# EAGLE design 80W Hi-Fi Power Amplifier (EAGLE 9.4.2)
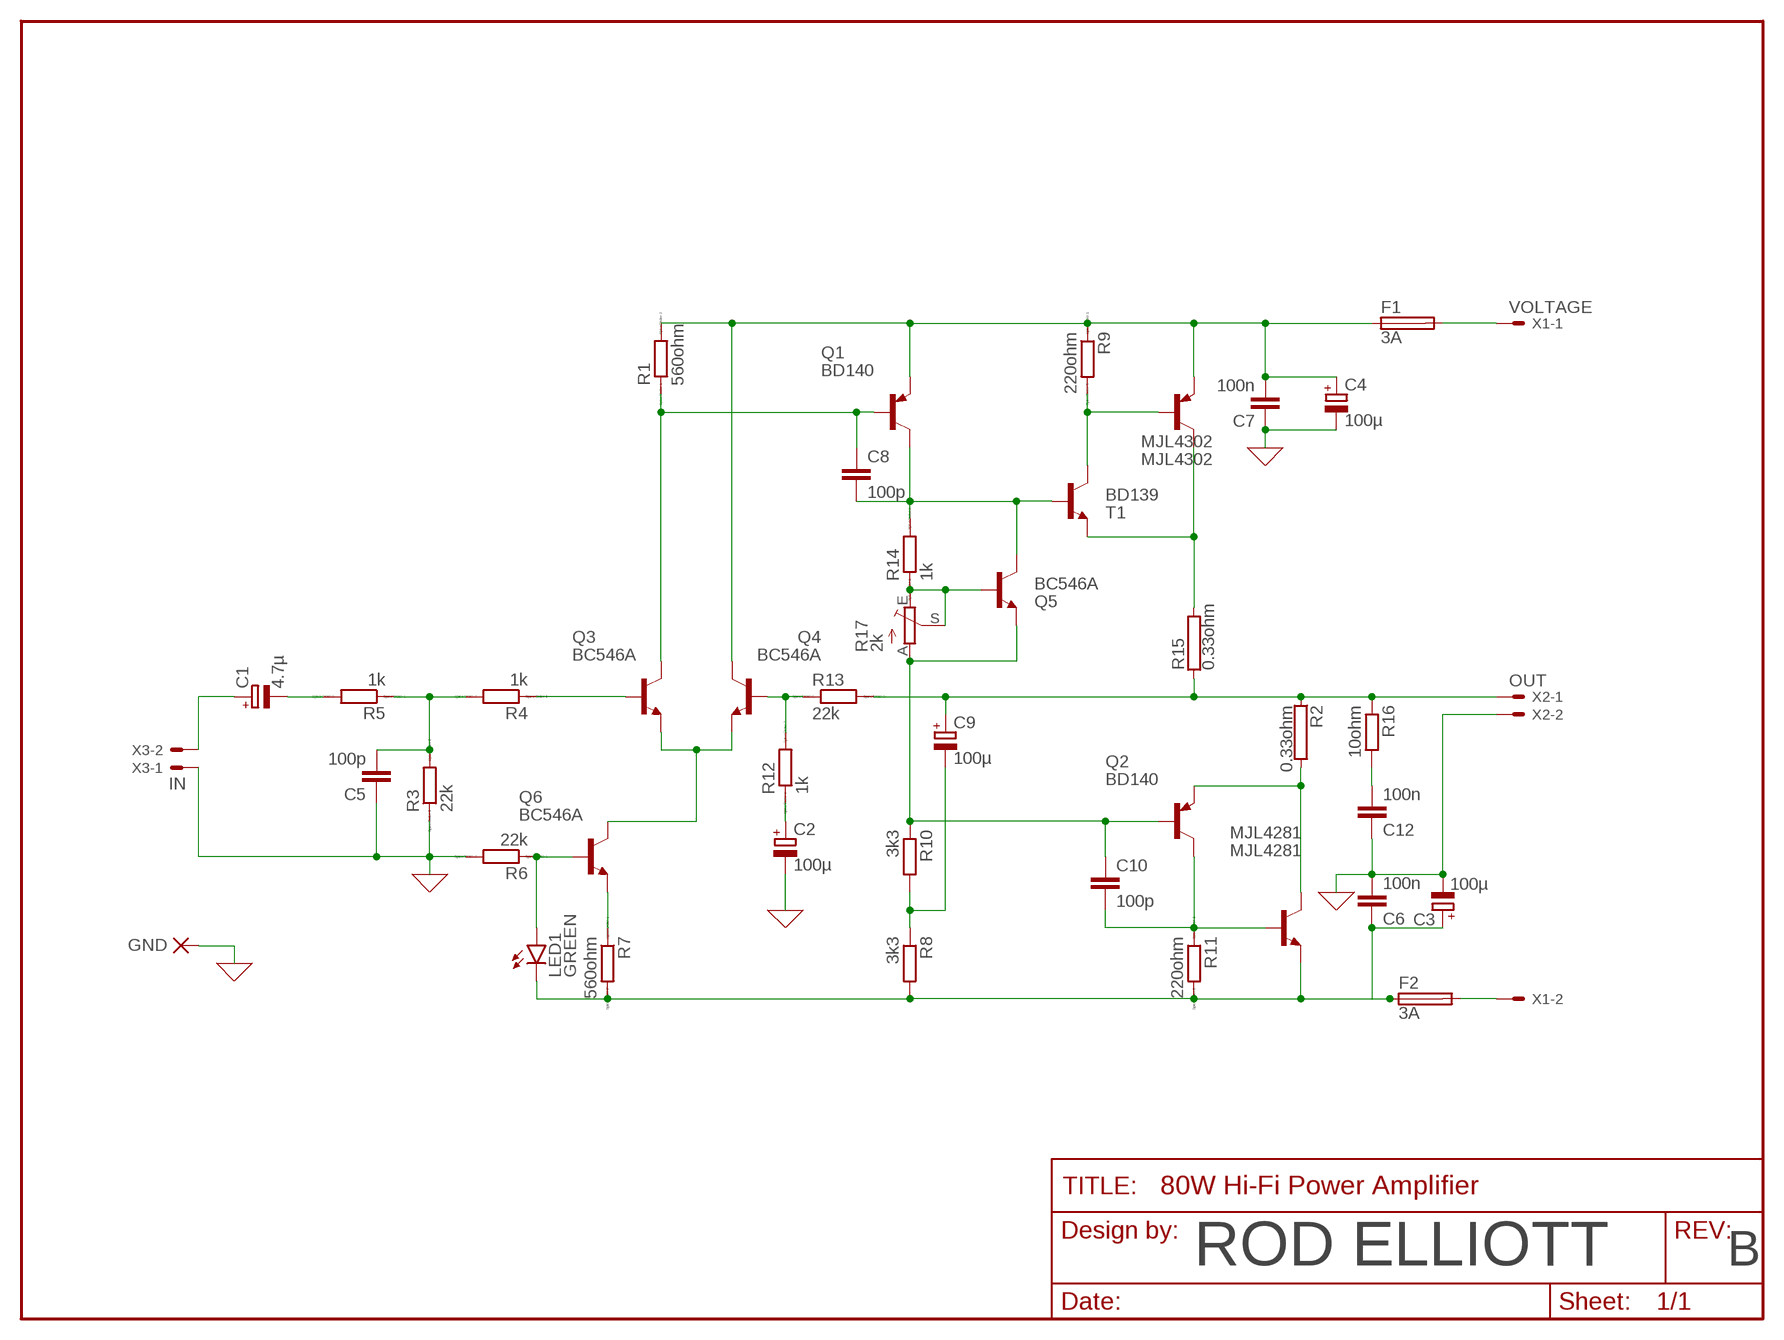
[diagram p0: schematic, sheet 1]

## Parts
C1  4.7µ  CPOL-EUE2-5  [E2-5]
C2  100µ  CPOL-EUE3.5-8  [E3,5-8]
C3  100µ  CPOL-EUE3.5-8  [E3,5-8]
C4  100µ  CPOL-EUE3.5-8  [E3,5-8]
C5  100p  C-EU025-024X044  [C025-024X044]
C6  100n  C-EU025-024X044  [C025-024X044]
C7  100n  C-EU025-024X044  [C025-024X044]
C8  100p  C-EU025-024X044  [C025-024X044]
C9  100µ  CPOL-EUE3.5-10  [E3,5-10]
C10  100p  C-EU025-024X044  [C025-024X044]
C12  100n  C-EU025-024X044  [C025-024X044]
F1  3A  FUSEBLANK_5X20MM  [FUSE_HOLDER_5X20MM]
F2  3A  FUSEBLANK_5X20MM  [FUSE_HOLDER_5X20MM]
FRAME1  FRAME-LETTERNO_PACKAGE  [DUMMY]
GND  PAD-SMD20S  [SMD20S]
LED1  GREEN  LED5MM  [LED5MM]
MJL4281  MJL4281  [TO-264]
MJL4302  MJL4302  [TO-264]
Q1  BD140  [TO126]
Q2  BD140  [TO126]
Q3  BC546A  [TO92-EBC]
Q4  BC546A  [TO92-EBC]
Q5  BC546A  [TO92-EBC]
Q6  BC546A  [TO92-EBC]
R1  560ohm  R0207/10  [0207/10]
R2  0.33ohm  RHPS923  [HPS923]
R3  22k  R0207/10  [0207/10]
R4  1k  R0207/10  [0207/10]
R5  1k  R0207/10  [0207/10]
R6  22k  R0207/10  [0207/10]
R7  560ohm  R0207/10  [0207/10]
R8  3k3  R-EU_0309/10  [0309/10]
R9  220ohm  R0207/10  [0207/10]
R10  3k3  R-EU_0309/10  [0309/10]
R11  220ohm  R0207/10  [0207/10]
R12  1k  R0207/10  [0207/10]
R13  22k  R0207/10  [0207/10]
R14  1k  R0207/10  [0207/10]
R15  0.33ohm  RHPS923  [HPS923]
R16  10ohm  R-EU_0309/10  [0309/10]
R17  2k  TRIM_EU-CA6V  [CA6V]
T1  BD139  [TO126]
X1  VOLTAGE  22-23-2021  [22-23-2021]
X2  OUT  22-23-2021  [22-23-2021]
X3  IN  22-23-2021  [22-23-2021]

## Nets
0: C2.- C3.- C4.- C5.1 C6.2 C7.1 C12.1 GND.PAD(P) R3.1 R6.2 X2.2 X3.1 ; supply symbol labelled GND
N$1: C5.2 R3.2 R4.2 R5.1
N$2: C1.- R5.2
N$3: C12.2 R16.2
N$4: C9.- R8.1 R10.2
N$5: Q3.B R4.1
N$6: Q6.E R7.1
N$7: LED1.A Q6.B R6.1
N$8: C2.+ R12.1
N$9: Q4.B R12.2 R13.1
N$10: Q3.E Q4.E Q6.C
N$11: Q5.B R14.1 R17.E R17.S
N$12: C8.2 Q1.2(C) Q5.C R14.2 T1.3(B)
N$13: MJL4302.C R15.2 T1.1(E)
N$14: C8.1 Q1.3(B) Q3.C R1.1
N$15: MJL4302.B R9.2 T1.2(C)
N$16: MJL4281.C Q2.1(E) R2.2
N$17: C4.+ C7.2 F1.1 MJL4302.E Q1.1(E) Q4.C R1.2 R9.1
N$18: C3.+ C6.1 F2.1 LED1.K(C) MJL4281.E R7.2 R8.2 R11.2
N$19: C1.+ X3.2
N$20: C9.+ R2.1 R13.2 R15.1 R16.1 X2.1
N$21: C10.2 MJL4281.B Q2.2(C) R11.1
N$22: C10.1 Q2.3(B) Q5.E R10.1 R17.A
N$23: F2.2 X1.2
N$24: F1.2 X1.1

## Notes on the sheet
- ROD ELLIOTT | B

## Library data of the parts
C1-C4 = rcl:CPOL-EU: POLARIZED CAPACITOR, European symbol; SPICEPREFIX: C
C5-C8 C12 = rcl:C-EU: CAPACITOR, European symbol; SPICEPREFIX: C
C9 = resistor:CPOL-EU: POLARIZED CAPACITOR, European symbol
C10 = resistor:C-EU: CAPACITOR, European symbol
F1 F2 = fuse:FUSE: Fuse; OC_FARNELL: unknown; OC_NEWARK: unknown
FRAME1 = SparkFun-Aesthetics:FRAME-LETTER: Schematic Frame - Letter Standard 8.5x11 US Letter frame; DESIGNER: Nobody; VERSION: v01
GND = dpads:PAD: WIRE PAD Standard US Drill Sizes and SMD pads
LED1 = led:LED: LED OSRAM: - CHIPLED LG R971, LG N971, LY N971, LG Q971, LY Q971, LO R971, LY R971 LH N974, LH R974 LS Q976, LO Q976, LY Q976 LO Q996 - Hyper CHIPLED LW Q18S LB Q993, LB Q99A, LB R99A - SideLED LS A670, LO A670, LY A670, LG A670, LP A670 LB A673, LV A673, LT A673, LW A673 LH A674 LY A675 LS A676, LA A676, LO A676, LY A676, LW A676 LS A679, LY A679, LG A679 - Hyper Micro SIDELED® LS Y876, LA Y876, LO Y876, LY Y876 LT Y87S - SmartLED LW L88C, LW L88S LB L89C, LB L89S, LG L890 LS L89K, LO L89K, LY L89K LS L896, LA L896, LO L896, LY L896 - TOPLED LS T670, LO T670, LY T670, LG T670, LP T670 LSG T670, LSP T670, LSY T670, LOP T670, LYG T670 LG T671, LOG T671, LSG T671 LB T673, LV T673, LT T673, LW T673 LH T674 LS T676, LA T676, LO T676, LY T676, LB T676, LH T676, LSB T676, LW T676 LB T67C, LV T67C, LT T67C, LS T67K, LO T67K, LY T67K, LW E67C LS E67B, LA E67B, LO E67B, LY E67B, LB E67C, LV E67C, LT E67C LW T67C LS T679, LY T679, LG T679 LS T770, LO T770, LY T770, LG T770, LP T770 LB T773, LV T773, LT T773, LW T773 LH T774 LS E675, LA E675, LY E675, LS T675 LS T776, LA T776, LO T776, LY T776, LB T776 LHGB T686 LT T68C, LB T68C - Hyper Mini TOPLED® LB M676 - Mini TOPLED Santana® LG M470 LS M47K, LO M47K, LY M47K Source: http://www.osram.convergy.de LUXEON: - LUMILED® LXK2-PW12-R00, LXK2-PW12-S00, LXK2-PW14-U00, LXK2-PW14-V00 LXK2-PM12-R00, LXK2-PM12-S00, LXK2-PM14-U00 LXK2-PE12-Q00, LXK2-PE12-R00, LXK2-PE12-S00, LXK2-PE14-T00, LXK2-PE14-U00 LXK2-PB12-K00, LXK2-PB12-L00, LXK2-PB12-M00, LXK2-PB14-N00, LXK2-PB14-P00, LXK2-PB14-Q00 LXK2-PR12-L00, LXK2-PR12-M00, LXK2-PR14-Q00, LXK2-PR14-R00 LXK2-PD12-Q00, LXK2-PD12-R00, LXK2-PD12-S00 LXK2-PH12-R00, LXK2-PH12-S00 LXK2-PL12-P00, LXK2-PL12-Q00, LXK2-PL12-R00 Source: www.luxeon.com KINGBRIGHT: KA-3528ASYC Source: www.kingbright.com
MJL4281 = Rudi_TO264:MJL4281: MJL4281 NPN BCE TO-264
MJL4302 = Rudi_TO264:MJL4302: MJL4302 PNP BCE TO-264
Q1 Q2 = transistor-pnp:BD140: PNP Transistor
Q3-Q6 = transistor-npn:BC546*: NPN Transistor
R1 R3-R7 R9 R11-R14 = eagle-ltspice:R: RESISTOR, European symbol; SPICEMODEL: NONE; SPICEPREFIX: R
R2 R15 = resistor-power:R: Power Resitor; OC_FARNELL: unknown; OC_NEWARK: unknown
R8 R10 R16 = resistor:R-EU_: RESISTOR, European symbol
R17 = pot:TRIM_EU-: POTENTIOMETER
T1 = transistor:BD139: NPN TRANSISTOR
X1-X3 = con-molex:22-23-2021: .100" (2.54mm) Center Header - 2 Pin; MF: MOLEX; MPN: 22-23-2021; OC_FARNELL: 1462926; OC_NEWARK: 25C3832

## Board
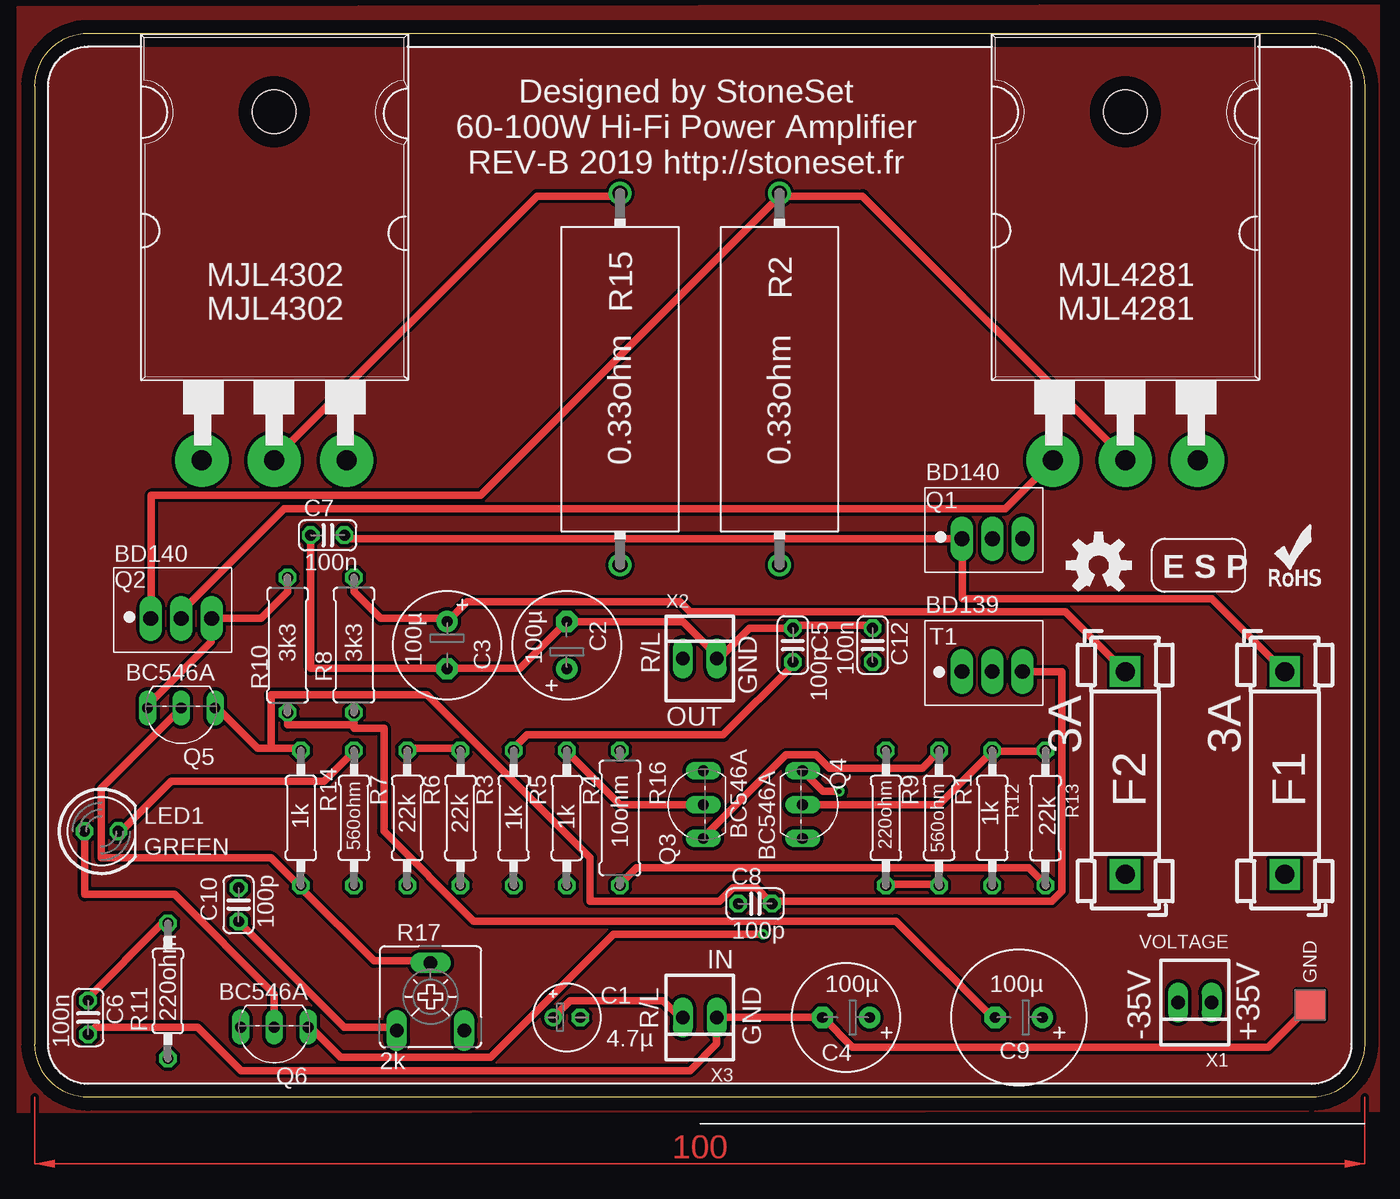
[diagram p1: board, top side]
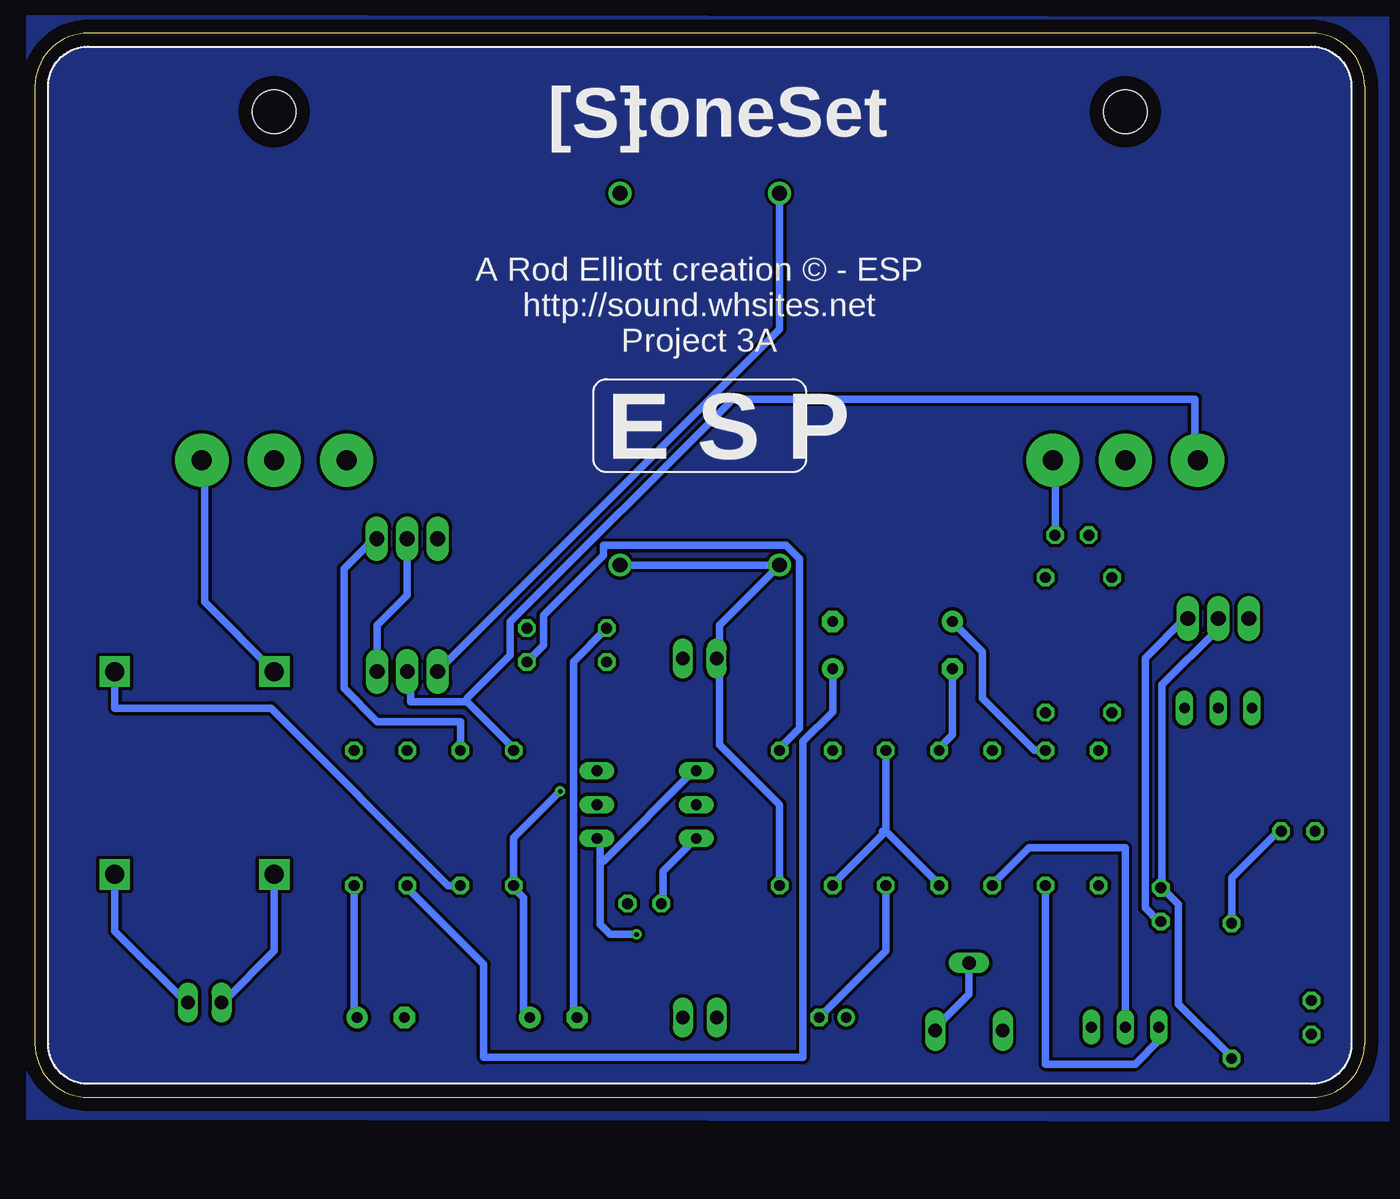
[diagram p2: board, bottom side, seen from below]

Size 100 x 80 mm. Coordinates in mm from the lower left corner, seen from the top.
Outline: 0,76 0,4 arc90 4,0 96,0 arc90 100,4 100,76 arc90 96,80 4,80 arc90 0,76
Copper layers (1*16): Top 0.035mm / dielectric 1.5mm / Bottom 0.035mm
Design rules "default *": minimum track width 0.55mm, minimum drill 0.35mm, track to track 10mil, track to pad 6mil, pad to pad 6mil, via to via 6mil, smd to smd 6mil, copper to edge 40mil, drill to drill 6mil, minimum pad ring 10mil, minimum via ring 8mil, stop-mask expansion 4mil, vias tented up to drill 0mil, thermal gap 10mil

### Footprints (pad centres in the part's own frame; a part is rotated, then mirrored left to right if it is on the bottom)
E2-5 = drill 0.813 pad 1.27: + -1.016,0 | drill 0.813 pad 1.27 octagon: - 1.016,0
E3,5-8 = drill 0.813 pad 1.6: + -1.778,0 | drill 0.813 pad 1.6 octagon: - 1.778,0
C025-024X044 = drill 0.813 octagon: 1 -1.27,0; 2 1.27,0
E3,5-10 = drill 0.813 pad 1.6: + -1.778,0 | drill 0.813 pad 1.6 octagon: - 1.778,0
FUSE_HOLDER_5X20MM = drill 1.422 pad 2.286 square: 1 0,0; 2 15.24,0
SMD20S = smd 2.159 x 2.159: PAD 0,0
LED5MM = drill 0.813 octagon: A -1.27,0; K 1.27,0
TO-264 = drill 1.5 pad 4: B -5.45,-6.096; E 5.45,-6.096 | drill 1.499 pad 4: C 0,-6.096 | hole 3.3: 0,20.09
TO126 = drill 1.118 long: 1 -2.286,0; 2 0,0; 3 2.286,0
TO92-EBC = drill 0.813 long: B 0,-1.27; C -2.54,-1.27; E 2.54,-1.27
0207/10 = drill 0.813 octagon: 1 -5.08,0; 2 5.08,0
HPS923 = drill 1.1 pad 1.7: 1 -13.97,0; 2 13.97,0
0309/10 = drill 0.813 octagon: 1 -5.08,0; 2 5.08,0
CA6V = drill 1.016 long: A -2.54,-2.54; E 2.54,-2.54; S 0,2.54
TO126' = drill 1.118 long: 1 -2.294,0.014; 2 -0.008,0.014; 3 2.278,0.014
22-23-2021 = drill 1 long: 1 -1.27,0; 2 1.27,0

### Placement (x,y rotation side)
C1  40,6 0 top
C2  40,34 90 top
C3  31,34 270 top
C4  61,6 180 top
C5  57,34 270 top
C6  4,6 270 top
C7  22.01,42.26 0 top
C8  54.16,14.56 0 top
C9  74,6 180 top
C10  15.32,14.48 90 top
C12  63,34 270 top
F1  94,32 270 top
F2  82,32 270 top
FRAME1  0.14,-0.01 0 top
GND  95.92,6.93 90 top
LED1  5,20 0 top
MJL4281  82,54 0 top
MJL4302  18,54 0 top
Q1  72,42 0 top
Q2  11,36 0 top
Q3  49,22 90 top
Q4  59,22 270 top
Q5  11,28 180 top
Q6  18,4 180 top
R1  68,21 270 top
R2  56,54 90 top
R3  32,21 270 top
R4  40,21 270 top
R5  36,21 270 top
R6  28,21 90 top
R7  24,21 90 top
R8  24,34 90 top
R9  64,21 90 top
R10  19,34 270 top
R11  10,8 90 top
R12  72,21 90 top
R13  76,21 270 top
R14  20,21 90 top
R15  44,54 90 top
R16  44,21 90 top
R17  29.75,7.56 0 top
T1  BD139  [TO126']  72,32 0 top
U$1  [OSHW-LOGO-M]  80,40 0 top
U$2  [ROHS_LOGO_0.18_IN]  92.62,38.33 0 top
X1  87.24,7.13 180 top
X2  50,33 0 top
X3  50,6 180 top

### Tracks (layer width: path | path; a pad name or v marks a point on that pad's centre or on a via)
0
  Top 0.55: C12.1 63,35.5 57,35.5 C5.1 56.75,35.25 53.75,35.25 51.5,33 X2.2 51.25,33.25 48.75,35.75 40.25,35.75 C2.- 40,35.75 36.5,32.25 31.25,32.25 C3.- 31,32.25 20.75,32.25 C7.1 | R6.2 28,26.25 32,26.25 R3.1 | GND.PAD 95.75,6.75 92.75,3.75 61.5,3.75 59.25,6 C4.- X3.1 51.27,4.02 49.25,2 15.5,2 12.25,5.25 4.52,5.25 C6.2
  Bottom 0.55: C3.- 31,27.25 32,26.25 R3.1 | C5.1 57,35.25 59.5,32.75 59.5,6.25 59.25,6 C4.-
GND
  pour Bottom: -1.78,-1.79 100.57,-1.66 100.57,81.34 -1.78,81.21
N$1
  Top 0.55: C5.2 57,32.5 51.75,27.25 37,27.25 36,26.25 R5.1
  Bottom 0.55: 36,20 32,16 R3.2 | R5.1 36,20 | R4.2 40,16 36.25,19.75 36.25,20 36,20
N$2
  Bottom 0.55: R5.2 36,11 41,6 C1.-
N$3
  Bottom 0.55: R16.2 44,26.25 42.5,27.75 42.5,40.5 43.5,41.5 57.25,41.5 57.25,40.75 61.75,36.25 61.75,34 63,32.75 C12.2
N$4
  Top 0.55: R10.2 19,28 24,28 R8.1 24,27.75 26.25,27.75 26.25,20 33,13.25 64.75,13.25 72,6 C9.-
N$5
  Top 0.55: Q3.B 44,22 40,26 R4.1
N$6
  Bottom 0.55: Q6.E 15.46,4.29 17.25,2.5 24,2.5 R7.1
N$7
  Top 0.55: Q6.B 18,7.75 10.5,15.25 3.75,15.25 3.75,20 LED1.A
  Bottom 0.55: Q6.B 18,18.75 25.25,18.75 28,16 R6.1
N$8
  Bottom 0.55: C2.+ 40,29 42.25,26.75 42.25,3 66.25,3 66.25,10 72,15.75 R12.1
N$9
  Top 0.55: Q4.B 68,22 72,26 R12.2 72.25,26 76,26 R13.1
N$10  (via drill 0.35)
  Top 0.55: v54.75,12.25 43.5,12.25 34.25,3 23,3 20.75,5.25 Q6.C
  Bottom 0.55: v54.75,12.25 56.75,12.25 57.5,13 57.5,17.75 | 57.5,17.75 57.5,19.25 Q4.E | Q3.E 50.5,24.5 57.25,17.75 57.5,17.75
N$11
  Top 0.55: R17.S 29.75,10.25 25.5,10.25 20,15.75 R14.1 19.75,16 17.75,18 5,18 5,23.25 11,29.25 Q5.B
  Bottom 0.55: R17.S 29.75,7.75 32.25,5.25 R17.E
N$12
  Top 0.55: 17.75,26.25 20,26.25 R14.2 | 17.75,26.25 16.75,26.25 13.75,29.25 Q5.C | T1.3 74.5,32 77.25,32 77.25,15.5 76.5,14.75 55.5,14.75 C8.2 55.25,14.75 54.25,15.75 52.5,15.75 51.5,14.75 41.75,14.75 41.75,18 29.5,30.25 17.75,30.25 17.75,26.25
  Bottom 0.55: Q1.2 72,37.75 74.25,35.5 74.25,32.25 T1.3
N$13
  Top 0.55: MJL4302.C 18,48 37.75,67.75 44,67.75 R15.2
  Bottom 0.55: R15.2 44,57.75 69.5,32.25 T1.1
N$14
  Top 0.55: R1.1 68,26 66.75,24.75 59.75,24.75 58.75,25.75 56.5,25.75 50.25,19.5 Q3.C
  Bottom 0.55: Q3.C 50.5,19.25 52.75,17 52.75,14.75 C8.1 | R1.1 68,28.25 74.25,28.25 76.75,30.75 76.75,39.75 74.5,42 Q1.3
N$15
  Bottom 0.55: 67.5,29.75 64,26.25 R9.2 | 67.5,29.75 71.75,29.75 71.75,32 T1.2 | 67.5,29.75 67.5,30 64.25,33.25 64.25,35.75 47.5,52.5 12.75,52.5 12.75,48 MJL4302.B
N$16
  Top 0.55: Q2.1 8.75,36 8.75,45.25 33.5,45.25 56,67.75 R2.2 56.25,67.75 62.25,67.75 82,48 MJL4281.C
N$17  (via drill 0.35)
  Top 0.55: R9.1 64,16 68,16 R1.2 | v60.5,23 59.25,23 57.75,24.5 Q4.C | F1.1 88.5,37.5 69.75,37.5 69.75,42 Q1.1 23.75,42 23.5,42.25 C7.2
  Bottom 0.55: v60.5,23 64,19.5 R9.1 64,15.75 63.25,15 63.25,6.25 63,6 C4.+ | C7.2 23.25,42.5 23.25,47.75 MJL4302.E | R1.2 68.92,15.92 82.25,29.25 94,29.25 F1.1
N$18
  Top 0.55: C6.1 4,7.5 9.5,13 10,13 R11.2 | R8.2 24,38 26,36 31,36 C3.+ 31.25,36 32.5,37.25 48.5,37.25 49.25,36.5 77.5,36.5 F2.1 | LED1.K 6.5,20 10.25,23.75 21.75,23.75 24,26 R7.2
  Bottom 0.55: F2.1 87.25,37.25 87.25,47.75 MJL4281.E | R11.2 10,16.5 6.5,20 LED1.K | R7.2 24.83,26.08 28.75,30 28.75,33.5 31,35.75 C3.+
N$19
  Top 0.55: C1.+ 39,6 40.25,7.25 47.25,7.25 48.5,6 X3.2
N$20
  Top 0.55: R13.2 76,16 74.75,17.25 45.25,17.25 44,16 R16.1
  Bottom 0.55: R13.2 76,6 C9.+ | R16.1 44,22 48.5,26.5 48.5,33 X2.1 48.5,33.25 48.5,35.5 44,40 R15.1 44.25,40 56,40 R2.1
N$21
  Top 0.55: Q2.2 11,36.5 18.75,44.25 73,44.25 76.5,47.75 MJL4281.B
  Bottom 0.55: R11.1 10,3 14,7 14,14.5 15.25,15.75 C10.2 15.25,16 15.25,31 11.12,35.12 11,35 Q2.2
N$22
  Top 0.55: Q5.E 8.5,29.5 13.25,34.25 13.25,36 Q2.3 17,36 19,38 R10.1 | C10.1 15.5,13 23.25,5.25 27,5.25 R17.A
  Bottom 0.55: Q2.3 13.5,36 16.5,33 16.5,14.25 15.5,13.25 C10.1
N$23
  Bottom 0.55: F2.2 82,11 85.75,7.25 X1.2
N$24
  Bottom 0.55: F1.2 94,12.5 88.75,7.25 X1.1
VCC
  pour Top: -1.32,-1.14 101.11,-1.01 101.11,82.1 -1.32,81.97
(copper drawn outside any net)
  shapes: Top area x1

### Text on the board
tPlace: Designed by StoneSet / 60-100W Hi-Fi Power Amplifier / REV-B 2019 http://stoneset.fr | E S P | R/L | GND | R/L | GND | -35V | +35V
bPlace: toneSet | [S] | A Rod Elliott creation © - ESP / http://sound.whsites.net / Project 3A | E S P